# Altium schematic sheet 海关全向控制器主控板电路V4_电源管理.SchDoc
size A4
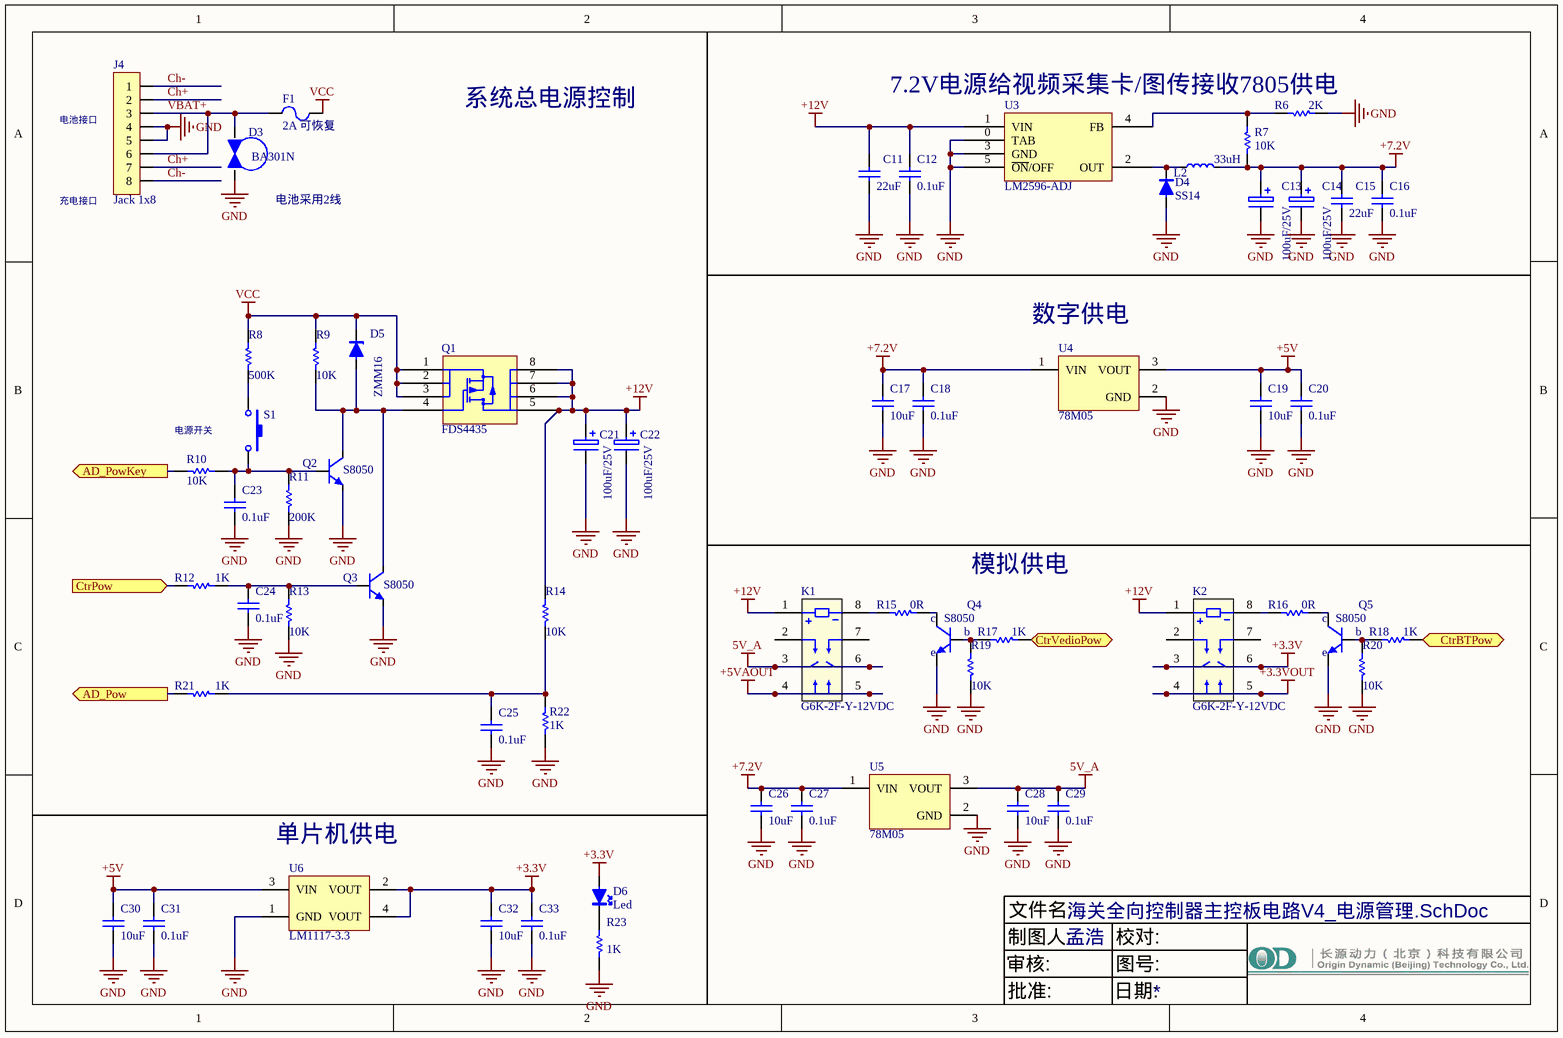
[diagram p0: 海关全向控制器主控板电路V4_电源管理.SchDoc]

## Parts
C11  22uF  [C1210]
C12  0.1uF  [C0805]
C13  100uF/25V  [C7343]
C14  100uF/25V  [C7343]
C15  22uF  [C1210]
C16  0.1uF  [C0805]
C17  10uF  [C0805]
C18  0.1uF  [C0805]
C19  10uF  [C0805]
C20  0.1uF  [C0805]
C21  100uF/25V  [C7343]
C22  100uF/25V  [C7343]
C23  0.1uF  [C0805]
C24  0.1uF  [C0805]
C25  0.1uF  [C0805]
C26  10uF  [C0805]
C27  0.1uF  [C0805]
C28  10uF  [C0805]
C29  0.1uF  [C0805]
C30  10uF  [C0805]
C31  0.1uF  [C0805]
C32  10uF  [C0805]
C33  0.1uF  [C0805]
D3  BA301N  [BA301N]
D4  SS14  [SMA]
D5  ZMM16  [SOD-80-S]
D6  Led  [LED0805]
F1  2A 可恢复  [F1812]
J4  Jack 1x8  [Pow-8P-M]
K1  G6K-2F-Y-12VDC  [G6K-2F-Y]
K2  G6K-2F-Y-12VDC  [G6K-2F-Y]
L2  33uH  [L6.6*7.1mm]
Q1  FDS4435  [SO8]
Q2  S8050  [SOT-23]
Q3  S8050  [SOT-23]
Q4  S8050  [SOT-23]
Q5  S8050  [SOT-23]
R6  2K  [R0805]
R7  10K  [R0805]
R8  500K  [R0805]
R9  10K  [R0805]
R10  10K  [R0805]
R11  200K  [R0805]
R12  1K  [R0805]
R13  10K  [R0805]
R14  10K  [R0805]
R15  0R  [R0805]
R16  0R  [R0805]
R17  1K  [R0805]
R18  1K  [R0805]
R19  10K  [R0805]
R20  10K  [R0805]
R21  1K  [R0805]
R22  1K  [R0805]
R23  1K  [R0805]
S1  SW-PB  [35363-0260]  (value not drawn)
U3  LM2596-ADJ  [TO-263-5]
U4  78M05  [TO-252]
U5  78M05  [TO-252]
U6  LM1117-3.3  [SOT-223]

## Ports
AD_Pow (out), AD_PowKey (out), CtrBTPow (in), CtrPow (in), CtrVedioPow (in)

## Nets
5V_A: C28.1 C29.1 K1.3 K1.6 U5.3(VOUT)
+3.3V: C32.1 C33.1 D6.1(A) K2.3 K2.6 U6.2(VOUT) U6.4(VOUT)
+3.3VOUT: K2.4 K2.5
+5V: C19.1 C20.1 C30.1 C31.1 U4.3(VOUT) U6.3(VIN)
+5VAOUT: K1.4 K1.5
+7.2V: C13.1 C14.1 C15.1 C16.2 C17.1 C18.1 C26.1 C27.1 L2.2 R7.2 U4.1(VIN) U5.1(VIN)
+12V: C11.1 C12.2 C21.1 C22.1 K1.1 K2.1 Q1.5 Q1.6 Q1.7 Q1.8 R14.1 U3.1(VIN)
GND: C11.2 C12.1 C13.2 C14.2 C15.2 C16.1 C17.2 C18.2 C19.2 C20.2 C21.2 C22.2 C23.2 C24.2 C25.2 C26.2 C27.2 C28.2 C29.2 C30.2 C31.2 C32.2 C33.2 D3.2 D4.1(A) J4.4 J4.5 Q2.2(E) Q3.2(E) Q4.2(e) Q5.2(e) R6.1 R11.2 R13.2 R19.2 R20.2 R22.1 R23.2 U3.0(TAB) U3.3(GND) U3.5(~{ON}/OFF) U4.2(GND) U5.2(GND) U6.1(GND)
VCC: D5.2(K) F1.2 Q1.1 Q1.2 Q1.3 R8.1 R9.1
AD_Pow: R21.1 ; port AD_Pow
AD_PowKey: R10.1 ; port AD_PowKey
Ch+: J4.2 J4.7
Ch-: J4.1 J4.8
CtrBTPow: R18.2 ; port CtrBTPow
CtrPow: R12.1 ; port CtrPow
CtrVedioPow: R17.2 ; port CtrVedioPow
VBAT+: D3.1 F1.1 J4.3 J4.6
NetC23_1: C23.1 Q2.1(B) R10.2 R11.1 S1.2
NetC24_1: C24.1 Q3.1(B) R12.2 R13.1
NetC25_1: C25.1 R14.2 R21.2 R22.2
NetD4_2: D4.2(K) L2.1 U3.2(OUT)
NetD5_1: D5.1(A) Q1.4 Q2.3(C) Q3.3(C) R9.2
NetD6_2: D6.2(K) R23.1
NetK1_8: K1.8 R15.1
NetK2_8: K2.8 R16.1
NetQ4_1: Q4.1(b) R17.1 R19.1
NetQ4_3: Q4.3(c) R15.2
NetQ5_1: Q5.1(b) R18.1 R20.1
NetQ5_3: Q5.3(c) R16.2
NetR6_2: R6.2 R7.1 U3.4(FB)
NetR8_2: R8.2 S1.1

Not connected (* = marked no-connect by the designer): K1 2 7; K2 2 7

## Notes on the sheet
- 系统总电源控制
- (near U3) 7.2V电源给视频采集卡/图传接收7805供电
- 电池接口
- 充电接口
- (near D3) 电池采用2线
- (near U4) 数字供电
- (near R10) 电源开关
- 模拟供电
- (near U6) 单片机供电
- 文件名:
- 审核:
- 制图人:
- 孟浩
- 校对:
- 图号:
- 批准:
- 日期:

## Library data of the parts
C11 C12 C15-C20 C23-C33 = CAP: Published: 8-Jun-2000; LatestRevisionDate: 17-Jul-2002; LatestRevisionNote: Re-released for DXP Platform.; PackageReference: RAD-0.3; Publisher: Altium Limited
C13 C14 = ELECTRO: Electrolytic Capacitor
C21 C22 = Cap Poll
D4 = Diode-Switch: Silicon Epitaxial Planar Diodes
D5 = DIODE-ZENER: Small Signal Zener Diodes
D6 = Led: light emitted diode
F1 = Fuse1
J4 = Jack 1x8: 插座
K1 K2 = G6K-2F-Y
L2 = INDUCTOR: Code_IEC: 1005; Published: 8-Jun-2000; LatestRevisionDate: 17-Jul-2002; LatestRevisionNote: Re-released for DXP Platform.; PackageReference: 0402-A; Publisher: Altium Limited; Code_JEITA: 0402
Q2 Q3 = NPN: NPN General Purpose Amplifier; Published: 8-Jun-2000; LatestRevisionDate: 15-Jan-2003; LatestRevisionNote: PCB Footprint 'BCY-W3/D4.7' replaced; DatasheetDocument: 1997; PackageDocument: Sep-1998; PackageReference: TO-92A; Publisher: Altium Limited; Code_JEDEC: TO-92A; ComponentLink1Description: Manufacturer Link; ComponentLink1URL: http://www.fairchildsemi.com/; ComponentLink2Description: Datasheet; ComponentLink2URL: http://www.fairchildsemi.com/ds/2N%2F2N3904.pdf
Q4 Q5 = S8050: NPN triode, 0.5A Max
R6-R23 = Res
S1 = SW-PB: Switch; Published: 24-Mar-1999; LatestRevisionDate: 17-Jul-2002; LatestRevisionNote: Re-released for DXP Platform.; PackageReference: SPST-2; Publisher: Altium Limited; PackageDescription: Switch; 2 Leads
U3 = LM25x6-5: LM2596-5;LM2576-5
U6 = LM1117: 800mA Linear Voltage Regulator